# Altium schematic sheet BBB_Connections.SchDoc: BBB Connections
size Tabloid; DocumentNumber: LM-004; Revision: A; SheetNumber: 3; SheetTotal: 4
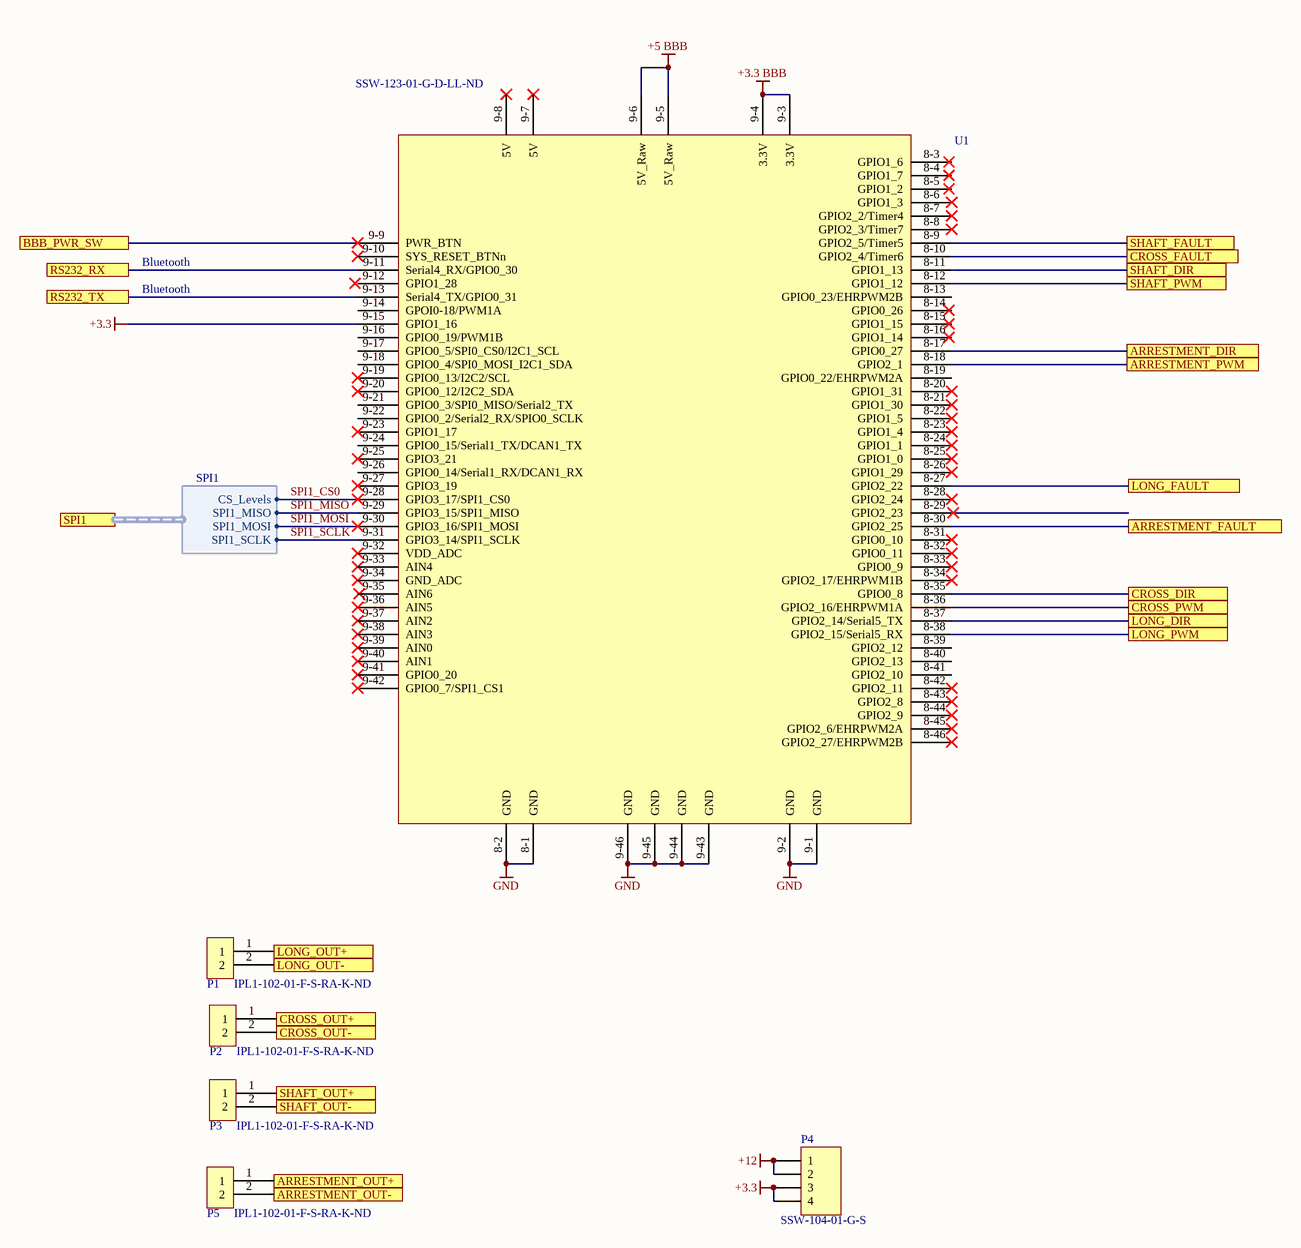
[diagram p0: BBB_Connections.SchDoc]

## Parts
P1  Supplier Part Number 1: IPL1-102-01-F-S-RA-K-ND  [IPL1-102-01-F-S-RA-K]  (hidden comment: IPL1-102-01-F-S-RA-K)
P2  Supplier Part Number 1: IPL1-102-01-F-S-RA-K-ND  [IPL1-102-01-F-S-RA-K]  (hidden comment: IPL1-102-01-F-S-RA-K)
P3  Supplier Part Number 1: IPL1-102-01-F-S-RA-K-ND  [IPL1-102-01-F-S-RA-K]  (hidden comment: IPL1-102-01-F-S-RA-K)
P4  SSW-104-01-G-S  [HDR1X4]
P5  Supplier Part Number 1: IPL1-102-01-F-S-RA-K-ND  [IPL1-102-01-F-S-RA-K]  (hidden comment: IPL1-102-01-F-S-RA-K)
U1  Supplier Part Number 1: SSW-123-01-G-D-LL-ND  [Beaglebone Black Mezanine]  (hidden comment: BBB)

## Ports
ARRESTMENT_DIR, ARRESTMENT_FAULT, ARRESTMENT_OUT+, ARRESTMENT_OUT-, ARRESTMENT_PWM, BBB_PWR_SW, CROSS_DIR, CROSS_FAULT, CROSS_OUT+, CROSS_OUT-, CROSS_PWM, LONG_DIR, LONG_FAULT, LONG_OUT+, LONG_OUT-, LONG_PWM, RS232_RX, RS232_TX, SHAFT_DIR, SHAFT_FAULT, SHAFT_OUT+, SHAFT_OUT-, SHAFT_PWM, SPI1 (harness SPI1)

## Harnesses
SPI1: CS_Levels, SPI1_MISO, SPI1_MOSI, SPI1_SCLK

## Nets
+3.3: P4.3 P4.4 U1.9-15(GPIO1_16)
+3.3 BBB: U1.9-3(3.3V) U1.9-4(3.3V)
+5 BBB: U1.9-5(5V_Raw) U1.9-6(5V_Raw)
+12: P4.1 P4.2
GND: U1.8-1(GND) U1.8-2(GND) U1.9-1(GND) U1.9-2(GND) U1.9-43(GND) U1.9-44(GND) U1.9-45(GND) U1.9-46(GND)
ARRESTMENT_DIR: U1.8-17(GPIO0_27) ; port ARRESTMENT_DIR
ARRESTMENT_FAULT: U1.8-30(GPIO2_25) ; port ARRESTMENT_FAULT
ARRESTMENT_OUT+: P5.1 ; port ARRESTMENT_OUT+
ARRESTMENT_OUT-: P5.2 ; port ARRESTMENT_OUT-
ARRESTMENT_PWM: U1.8-18(GPIO2_1) ; port ARRESTMENT_PWM
BBB_PWR_SW: U1.9-9(PWR_BTN) ; port BBB_PWR_SW
CROSS_DIR: U1.8-35(GPIO0_8) ; port CROSS_DIR
CROSS_FAULT: U1.8-10(GPIO2_4/Timer6) ; port CROSS_FAULT
CROSS_OUT+: P2.1 ; port CROSS_OUT+
CROSS_OUT-: P2.2 ; port CROSS_OUT-
CROSS_PWM: U1.8-36(GPIO2_16/EHRPWM1A) ; port CROSS_PWM
LONG_DIR: U1.8-37(GPIO2_14/Serial5_TX) ; port LONG_DIR
LONG_FAULT: U1.8-27(GPIO2_22) ; port LONG_FAULT
LONG_OUT+: P1.1 ; port LONG_OUT+
LONG_OUT-: P1.2 ; port LONG_OUT-
LONG_PWM: U1.8-38(GPIO2_15/Serial5_RX) ; port LONG_PWM
RS232_RX: U1.9-11(Serial4_RX/GPIO0_30) ; port RS232_RX
RS232_TX: U1.9-13(Serial4_TX/GPIO0_31) ; port RS232_TX
SHAFT_DIR: U1.8-11(GPIO1_13) ; port SHAFT_DIR
SHAFT_FAULT: U1.8-9(GPIO2_5/Timer5) ; port SHAFT_FAULT
SHAFT_OUT+: P3.1 ; port SHAFT_OUT+
SHAFT_OUT-: P3.2 ; port SHAFT_OUT-
SHAFT_PWM: U1.8-12(GPIO1_12) ; port SHAFT_PWM
SPI1_CS0: U1.9-28(GPIO3_17/SPI1_CS0) ; port SPI1.CS_Levels
SPI1_MISO: U1.9-29(GPIO3_15/SPI1_MISO) ; port SPI1.SPI1_MISO
SPI1_MOSI: U1.9-30(GPIO3_16/SPI1_MOSI) ; port SPI1.SPI1_MOSI
SPI1_SCLK: U1.9-31(GPIO3_14/SPI1_SCLK) ; port SPI1.SPI1_SCLK

Not connected (* = marked no-connect by the designer): U1 8-3(GPIO1_6) 8-4(GPIO1_7) 8-5(GPIO1_2) 8-6(GPIO1_3)* 8-7(GPIO2_2/Timer4)* 8-8(GPIO2_3/Timer7)* 8-13(GPIO0_23/EHRPWM2B) 8-14(GPIO0_26) 8-15(GPIO1_15) 8-16(GPIO1_14) 8-19(GPIO0_22/EHRPWM2A) 8-20(GPIO1_31)* 8-21(GPIO1_30)* 8-22(GPIO1_5)* 8-23(GPIO1_4)* 8-24(GPIO1_1)* 8-25(GPIO1_0)* 8-26(GPIO1_29)* 8-28(GPIO2_24)* 8-29(GPIO2_23) 8-31(GPIO0_10)* 8-32(GPIO0_11)* 8-33(GPIO0_9)* 8-34(GPIO2_17/EHRPWM1B)* 8-39(GPIO2_12) 8-40(GPIO2_13) 8-41(GPIO2_10) 8-42(GPIO2_11)* 8-43(GPIO2_8)* 8-44(GPIO2_9)* 8-45(GPIO2_6/EHRPWM2A)* 8-46(GPIO2_27/EHRPWM2B)* 9-7(5V)* 9-8(5V)* 9-10(SYS_RESET_BTNn)* 9-12(GPIO1_28) 9-14(GPOI0-18/PWM1A) 9-16(GPIO0_19/PWM1B) 9-17(GPIO0_5/SPI0_CS0/I2C1_SCL) 9-18(GPIO0_4/SPI0_MOSI_I2C1_SDA) 9-19(GPIO0_13/I2C2/SCL)* 9-20(GPIO0_12/I2C2_SDA)* 9-21(GPIO0_3/SPI0_MISO/Serial2_TX) 9-22(GPIO0_2/Serial2_RX/SPIO0_SCLK) 9-23(GPIO1_17)* 9-24(GPIO0_15/Serial1_TX/DCAN1_TX) 9-25(GPIO3_21)* 9-26(GPIO0_14/Serial1_RX/DCAN1_RX) 9-27(GPIO3_19)* 9-32(VDD_ADC)* 9-33(AIN4)* 9-34(GND_ADC)* 9-35(AIN6) 9-36(AIN5)* 9-37(AIN2)* 9-38(AIN3)* 9-39(AIN0)* 9-40(AIN1)* 9-41(GPIO0_20)* 9-42(GPIO0_7/SPI1_CS1)*

## Notes on the sheet
- Bluetooth
- Title
- Size:
- Date:
- Tabloid
- Number:
- Time:
- Revision:
- Sheet
- of
- ZLS Corporation
- 7801 North Lamar Blvd.
- Suite E-184
- Austin, Texas 78752  USA
- (512) 453-0288
- File:

## Library data of the parts
P1-P3 P5 = IPL1-102-01-F-S-RA-K: Manufacturer: Samtec Inc.; Connector Type: Header; Pitch - Mating: 0.100" (2.54mm); Number of Positions: 2; Number of Positions Loaded: All; Style: Board to Cable/Wire; Shrouding: Shrouded - 4 Wall; Contact Length - Mating: 0.215" (5.46mm); Contact Length - Post: 0.085" (2.16mm); Material Flammability Rating: UL94 V-0; Voltage Rating: 675VAC, 954VDC; Supplier 1: Digi-Key; Manufacturer Part Number: IPL1-102-01-F-S-RA-K; RoHS: RoHS Compliant; Category: Connectors, Interconnects; Stock 1: 0; Pricing 1: 1=2.09 (USD); Packaging: Tube; Part Status: Active; Contact Type: Male Pin; Number of Rows: 1; Row Spacing - Mating: -; Mounting Type: Through Hole, Right Angle; Termination: Solder; Fastening Type: Locking Ramp; Overall Contact Length: -; Insulation Height: 0.240" (6.10mm); Contact Shape: Square; Contact Finish - Mating: Gold; Contact Finish Thickness - Mating: 3.00µin (0.076µm); Contact Finish - Post: Tin; Contact Material: Phosphor Bronze; Insulation Material: Liquid Crystal Polymer (LCP); Features: -; Operating Temperature: -55°C ~ 125°C; Ingress Protection: -; Insulation Color: Natural; Current Rating: -; Mated Stacking Heights: -; Contact Finish Thickness - Post: -; Applications: -; ComponentLink1URL: http://suddendocs.samtec.com/prints/ipl1-1xx-xx-xxx-s-xx-x-xx-mkt.pdf; ComponentLink1Description: http://suddendocs.samtec.com/prints/ipl1-1xx-xx-xxx-s-xx-x-xx-mkt.pdf
P4 = Header 4: Header, 4-Pin; Manufacturer: Samtec Inc.; Connector Type: Receptacle; Style: Board to Board or Cable; Number of Positions: 4; Number of Positions Loaded: All; Pitch - Mating: 0.100" (2.54mm); Contact Length - Post: 0.104" (2.64mm); Material Flammability Rating: UL94 V-0; Current Rating: 5.7A per Contact; Supplier 1: Digi-Key; Supplier Part Number 1: SAM1209-04-ND; Manufacturer Part Number: SSW-104-01-G-S; RoHS: RoHS Compliant; Category: Connectors, Interconnects; Stock 1: 360; Pricing 1: 1=1.85, 10=1.654, 100=1.3623, 500=1.07684, 1000=0.9244, 5000=0.84331, 10000=0.81088 (USD); Packaging: Bulk; Part Status: Active; Contact Type: Forked; Row Spacing - Mating: -; Mounting Type: Through Hole; Termination: Solder; Fastening Type: Push-Pull; Contact Finish - Mating: Gold; Contact Finish Thickness - Mating: 20.0µin (0.51µm); Insulation Color: Black; Insulation Height: 0.335" (8.51mm); Operating Temperature: -55°C ~ 125°C; Contact Finish - Post: Gold; Mated Stacking Heights: -; Ingress Protection: -; Features: -; Voltage Rating: -; Applications: -; Insulation Material: Liquid Crystal Polymer (LCP); Contact Shape: Square; Contact Material: Phosphor Bronze; Contact Finish Thickness - Post: 3.00µin (0.076µm); ComponentLink1URL: http://suddendocs.samtec.com/prints/ssw-1xx-xx-xxx-x-xx-xxx-xx-mkt.pdf; ComponentLink1Description: http://suddendocs.samtec.com/prints/ssw-1xx-xx-xxx-x-xx-xxx-xx-mkt.pdf
U1 = Beaglebone_Black_Mezanine: Beaglebone Black; Manufacturer: Samtec Inc.; Manufacturer Part Number: SSW-123-01-G-D-LL; Connector Type: Receptacle; Style: Board to Board or Cable; Number of Positions: 46; Number of Positions Loaded: All; Pitch - Mating: 0.100" (2.54mm); Contact Length - Post: 0.104" (2.64mm); Material Flammability Rating: UL94 V-0; Current Rating: 5.7A per Contact; Supplier 1: Digi-Key; RoHS: RoHS Compliant; Category: Connectors, Interconnects; Stock 1: 0; Pricing 1: 1=6.07 (USD); Packaging: Bulk; Part Status: Active; Contact Type: Forked; Row Spacing - Mating: 0.100" (2.54mm); Mounting Type: Through Hole; Termination: Kinked Pin, Solder; Fastening Type: Push-Pull; Contact Finish - Mating: Gold; Contact Finish Thickness - Mating: 20.0µin (0.51µm); Insulation Color: Black; Insulation Height: 0.335" (8.51mm); Operating Temperature: -55°C ~ 125°C; Contact Finish - Post: Gold; Mated Stacking Heights: -; Ingress Protection: -; Features: -; Voltage Rating: -; Applications: -; Insulation Material: Liquid Crystal Polymer (LCP); Contact Shape: Square; Contact Material: Phosphor Bronze; Contact Finish Thickness - Post: 3.00µin (0.076µm)